# EAGLE design rfm12trx (EAGLE 6.0)
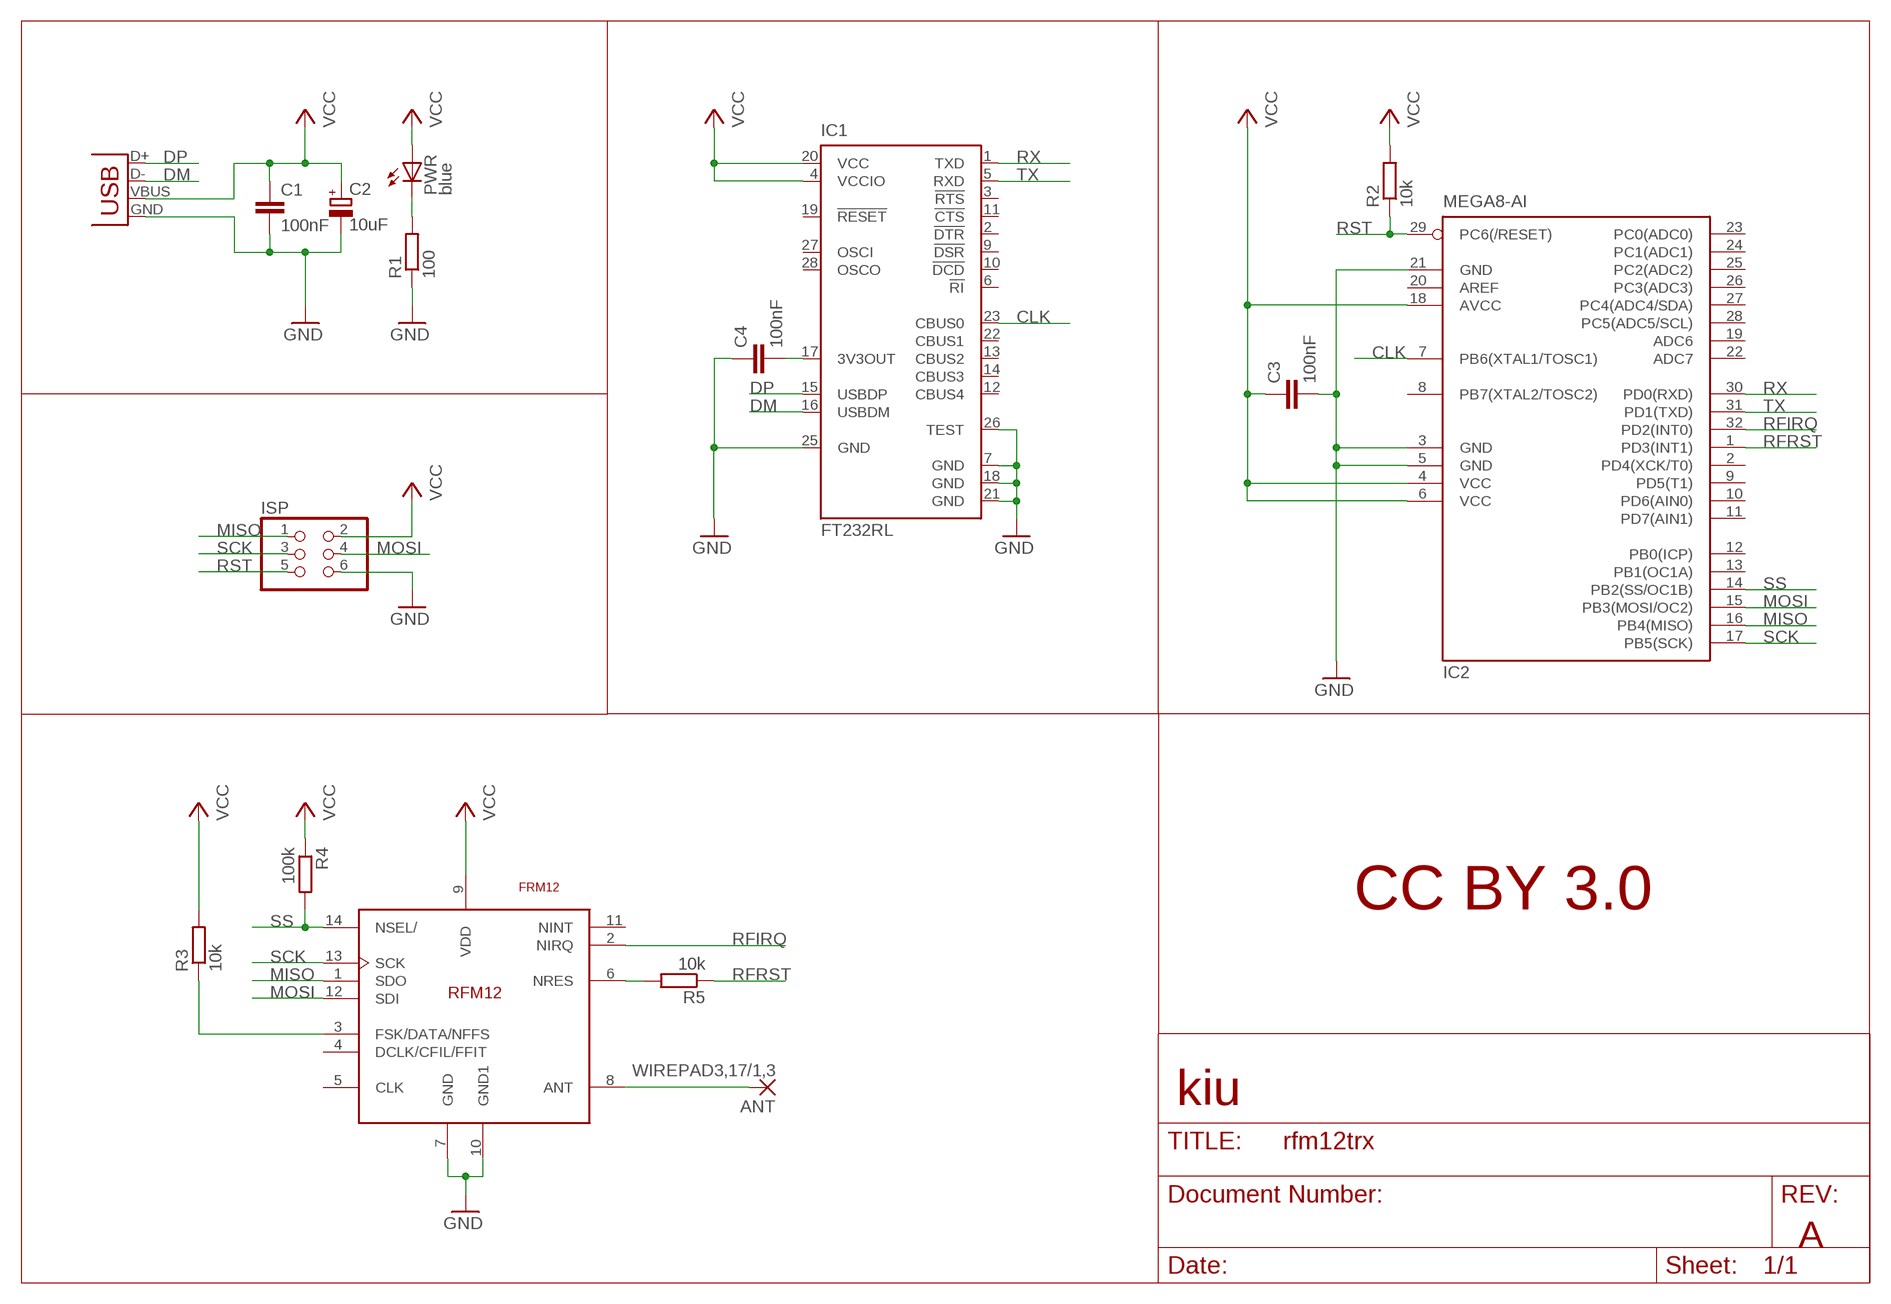
[diagram p0: schematic, sheet 1]

## Parts
ANT  WIREPAD3,17/1,3  [3,17/1,3]
C1  100nF  C-EUC0603  [C0603]
C2  10uF  CPOL-EUCT3216  [CT3216]
C3  100nF  C-EUC0603  [C0603]
C4  100nF  C-EUC0603  [C0603]
IC1  FT232RL  [SSOP28]
IC2  MEGA8-AI  [TQFP32-08]
ISP  PINHD-2X3  [2X03]
PWR  blue  LEDCHIP-LED0805  [CHIP-LED0805]
R1  100  R-EU_R0603  [R0603]
R2  10k  R-EU_R0603  [R0603]
R3  10k  R-EU_R0603  [R0603]
R4  100k  R-EU_R0603  [R0603]
R5  10k  R-EU_R0603  [R0603]
U$1  FRM12  [RFM12]
X1  USB-MICROB  [USB-MICROB]

## Nets
CLK: IC1.23(CBUS0) IC2.7(PB6(XTAL1/TOSC1))
DM: IC1.16(USBDM) X1.D-
DP: IC1.15(USBDP) X1.D+
GND: C1.2 C2.- C3.2 C4.1 IC1.7(GND) IC1.18(GND) IC1.21(GND) IC1.25(GND) IC1.26(TEST) IC2.3(GND) IC2.5(GND) IC2.21(GND) ISP.6 R1.1 U$1.7(GND) U$1.10(GND1) X1.GND
MISO: IC2.16(PB4(MISO)) ISP.1 U$1.1(SDO)
MOSI: IC2.15(PB3(MOSI/OC2)) ISP.4 U$1.12(SDI)
N$2: PWR.C R1.2
N$3: C4.2 IC1.17(3V3OUT)
N$13: R3.1 U$1.3(FSK/DATA/NFFS)
N$14: R5.2 U$1.6(NRES)
N$16: ANT.1(P) U$1.8(ANT)
RFIRQ: IC2.32(PD2(INT0)) U$1.2(NIRQ)
RFRST: IC2.1(PD3(INT1)) R5.1
RST: IC2.29(PC6(/RESET)) ISP.5 R2.1
RX: IC1.1(TXD) IC2.30(PD0(RXD))
SCK: IC2.17(PB5(SCK)) ISP.3 U$1.13(SCK)
SS: IC2.14(PB2(SS/OC1B)) R4.2 U$1.14(NSEL/)
TX: IC1.5(RXD) IC2.31(PD1(TXD))
VCC: C1.1 C2.+ C3.1 IC1.4(VCCIO) IC1.20(VCC) IC2.4(VCC) IC2.6(VCC) IC2.18(AVCC) ISP.2 PWR.A R2.2 R3.2 R4.1 U$1.9(VDD) X1.VBUS
Unconnected: IC1.2(!DTR) IC1.3(!RTS) IC1.6(!RI) IC1.9(!DSR) IC1.10(!DCD) IC1.11(!CTS) IC1.12(CBUS4) IC1.13(CBUS2) IC1.14(CBUS3) IC1.19(!RESET) IC1.22(CBUS1) IC1.27(OSCI) IC1.28(OSCO) IC2.2(PD4(XCK/T0)) IC2.8(PB7(XTAL2/TOSC2)) IC2.9(PD5(T1)) IC2.10(PD6(AIN0)) IC2.11(PD7(AIN1)) IC2.12(PB0(ICP)) IC2.13(PB1(OC1A)) IC2.19(ADC6) IC2.20(AREF) IC2.22(ADC7) IC2.23(PC0(ADC0)) IC2.24(PC1(ADC1)) IC2.25(PC2(ADC2)) IC2.26(PC3(ADC3)) IC2.27(PC4(ADC4/SDA)) IC2.28(PC5(ADC5/SCL)) U$1.4(DCLK/CFIL/FFIT) U$1.5(CLK) U$1.11(NINT)

## Notes on the sheet
- CC BY 3.0
- kiu
- A

## Library data of the parts
ANT = wirepad:WIREPAD: Wire PAD connect wire on PCB
C1 C3 C4 = rcl:C-EU: CAPACITOR, European symbol
C2 = rcl:CPOL-EU: POLARIZED CAPACITOR, European symbol
IC1 = ftdichip:FT232R: Source: http://www.ftdichip.com/Documents/DataSheets/DS_FT232R_v104.pdf; MPN: FT232RL; OC_FARNELL: 1146032; OC_NEWARK: 91K9918
IC2 = atmel:MEGA8: MICROCONTROLLER 8 Kbytes FLASH, 1 kbytes SRAM, 512 bytes EEPROM, USART, 6-channel 10 bit ADC, 2-channel 8 bit ADC Pin compatible with Atmega48, ATMega88, ATMega168 Source: avr.lbr; MPN: ATMEGA8-16AU; OC_FARNELL: 9171371; OC_NEWARK: 73M8863
ISP = pinhead:PINHD-2X3: PIN HEADER
PWR = led:LED: LED OSRAM: - CHIPLED LG R971, LG N971, LY N971, LG Q971, LY Q971, LO R971, LY R971 LH N974, LH R974 LS Q976, LO Q976, LY Q976 LO Q996 - Hyper CHIPLED LW Q18S LB Q993, LB Q99A, LB R99A - SideLED LS A670, LO A670, LY A670, LG A670, LP A670 LB A673, LV A673, LT A673, LW A673 LH A674 LY A675 LS A676, LA A676, LO A676, LY A676, LW A676 LS A679, LY A679, LG A679 - Hyper Micro SIDELED® LS Y876, LA Y876, LO Y876, LY Y876 LT Y87S - SmartLED LW L88C, LW L88S LB L89C, LB L89S, LG L890 LS L89K, LO L89K, LY L89K LS L896, LA L896, LO L896, LY L896 - TOPLED LS T670, LO T670, LY T670, LG T670, LP T670 LSG T670, LSP T670, LSY T670, LOP T670, LYG T670 LG T671, LOG T671, LSG T671 LB T673, LV T673, LT T673, LW T673 LH T674 LS T676, LA T676, LO T676, LY T676, LB T676, LH T676, LSB T676, LW T676 LB T67C, LV T67C, LT T67C, LS T67K, LO T67K, LY T67K, LW E67C LS E67B, LA E67B, LO E67B, LY E67B, LB E67C, LV E67C, LT E67C LW T67C LS T679, LY T679, LG T679 LS T770, LO T770, LY T770, LG T770, LP T770 LB T773, LV T773, LT T773, LW T773 LH T774 LS E675, LA E675, LY E675, LS T675 LS T776, LA T776, LO T776, LY T776, LB T776 LHGB T686 LT T68C, LB T68C - Hyper Mini TOPLED® LB M676 - Mini TOPLED Santana® LG M470 LS M47K, LO M47K, LY M47K Source: http://www.osram.convergy.de LUXEON: - LUMILED® LXK2-PW12-R00, LXK2-PW12-S00, LXK2-PW14-U00, LXK2-PW14-V00 LXK2-PM12-R00, LXK2-PM12-S00, LXK2-PM14-U00 LXK2-PE12-Q00, LXK2-PE12-R00, LXK2-PE12-S00, LXK2-PE14-T00, LXK2-PE14-U00 LXK2-PB12-K00, LXK2-PB12-L00, LXK2-PB12-M00, LXK2-PB14-N00, LXK2-PB14-P00, LXK2-PB14-Q00 LXK2-PR12-L00, LXK2-PR12-M00, LXK2-PR14-Q00, LXK2-PR14-R00 LXK2-PD12-Q00, LXK2-PD12-R00, LXK2-PD12-S00 LXK2-PH12-R00, LXK2-PH12-S00 LXK2-PL12-P00, LXK2-PL12-Q00, LXK2-PL12-R00 Source: www.luxeon.com KINGBRIGHT: KA-3528ASYC Source: www.kingbright.com
R1-R5 = rcl:R-EU_: RESISTOR, European symbol
U$1 = rfm12:FRM12
X1 = SparkFun:USB: USB Connectors USB-B-PTH is fully proven SKU : PRT-00139 USB-miniB is fully proven SKU : PRT-00587 USB-A-PCB is untested. USB-A-H is throughly reviewed, but untested. Spark Fun Electronics SKU : PRT-00437 USB-B-SMT is throughly reviewed, but untested. Needs silkscreen touching up. USB-A-S has not been used/tested USB-MB-H has not been used/tested

## Board
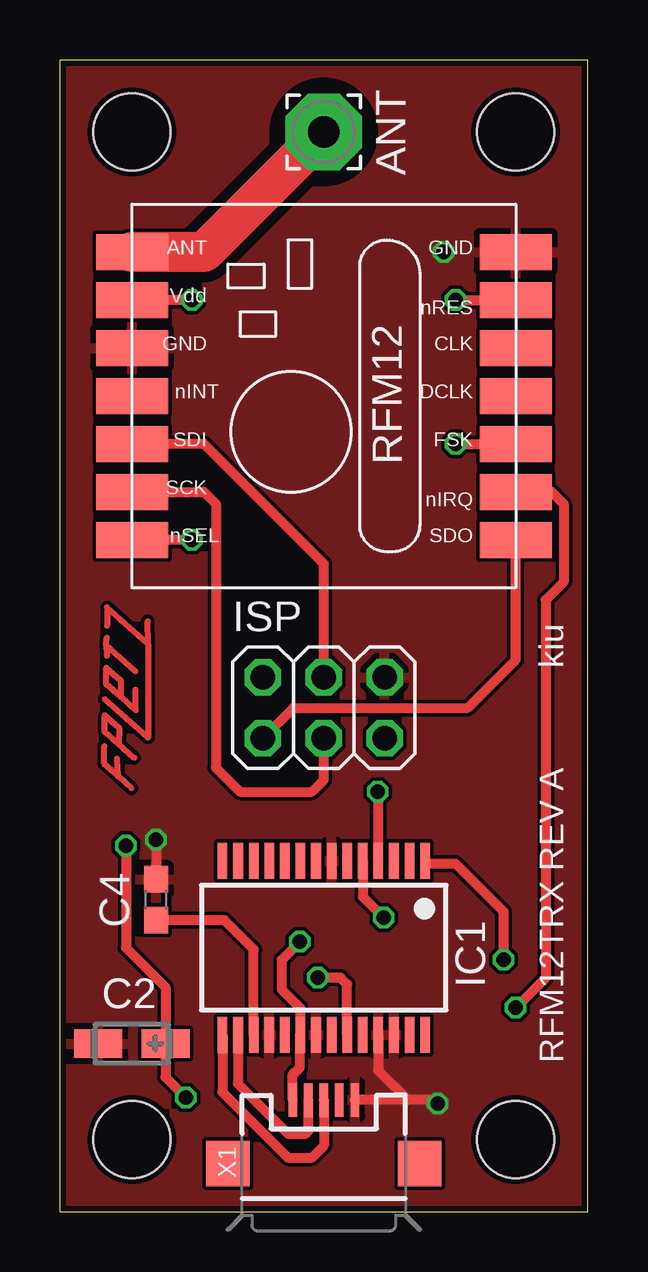
[diagram p1: board, top side]
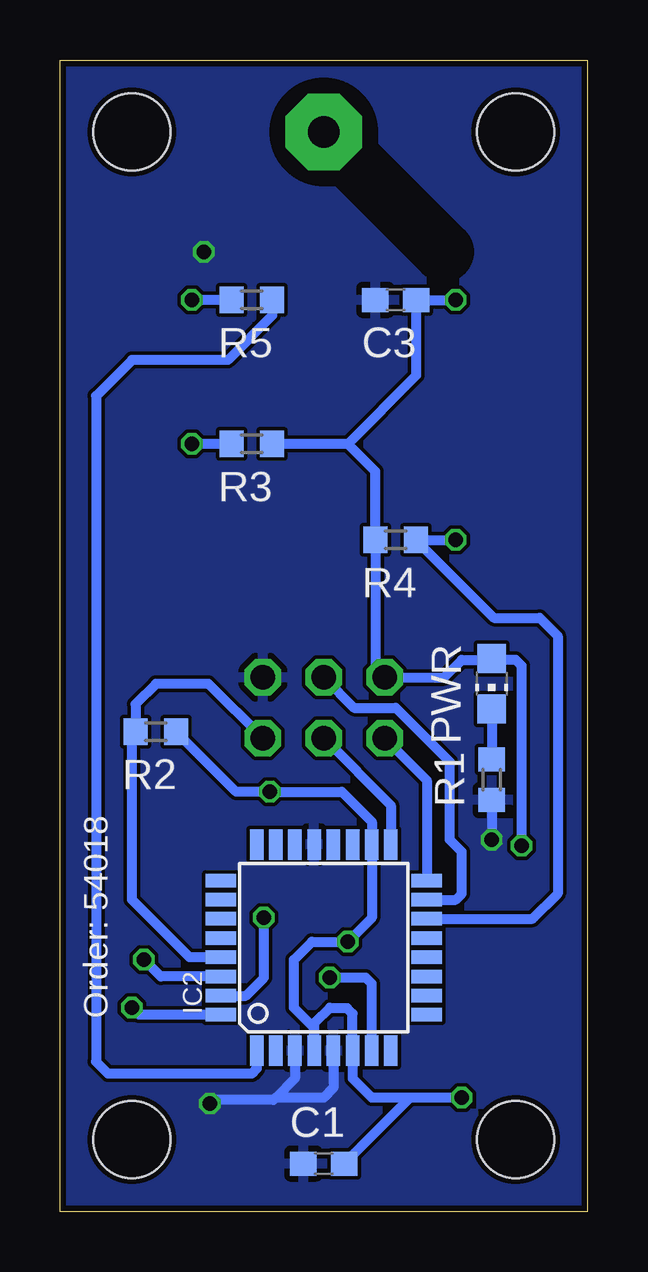
[diagram p2: board, bottom side, seen from below]

Size 22 x 48 mm. Coordinates in mm from the lower left corner, seen from the top.
Outline: 22,48 0,48 0,0 22,0 22,48
Copper layers (1*16): Top 0.035mm / dielectric 1.5mm / Bottom 0.035mm
Design rules: minimum track width 6mil, minimum drill 12mil, track to track 6mil, track to pad 6mil, pad to pad 6mil, via to via 6mil, smd to smd 0mil, copper to edge 10mil, drill to drill 10mil, minimum pad ring 10mil, minimum via ring 6mil, stop-mask expansion 2mil, vias tented up to drill 100mil, thermal gap 10mil
Holes 3.2 mm at 3,3 19,3 3,45 19,45
tRestrict: area 10,44 to 12,46; 1 lines
bRestrict: area 10,44 to 12,46; 1 lines

### Footprints (pad centres in the part's own frame; a part is rotated, then mirrored left to right if it is on the bottom)
3,17/1,3 = drill 1.321 pad 3.175 octagon: 1 0,0
C0603 = smd 1.1 x 1: 1 -0.85,0; 2 0.85,0
CT3216 = smd 2 x 1.2: + -1.4,0; - 1.4,0
SSOP28 = smd 0.4 x 1.5: 1 -4.225,-3.625; 2 -3.575,-3.625; 3 -2.925,-3.625; 4 -2.275,-3.625; 5 -1.625,-3.625; 6 -0.975,-3.625; 7 -0.325,-3.625; 8 0.325,-3.625; 9 0.975,-3.625; 10 1.625,-3.625; 11 2.275,-3.625; 12 2.925,-3.625; 13 3.575,-3.625; 14 4.225,-3.625; 15 4.225,3.625; 16 3.575,3.625; 17 2.925,3.625; 18 2.275,3.625; 19 1.625,3.625; 20 0.975,3.625; 21 0.325,3.625; 22 -0.325,3.625; 23 -0.975,3.625; 24 -1.625,3.625; 25 -2.275,3.625; 26 -2.925,3.625; 27 -3.575,3.625; 28 -4.225,3.625
TQFP32-08 = smd 1.27 x 0.559: 1 -4.293,2.8; 2 -4.293,2; 3 -4.293,1.2; 4 -4.293,0.4; 5 -4.293,-0.4; 6 -4.293,-1.2; 7 -4.293,-2; 8 -4.293,-2.8; 17 4.293,-2.8; 18 4.293,-2; 19 4.293,-1.2; 20 4.293,-0.4; 21 4.293,0.4; 22 4.293,1.2; 23 4.293,2; 24 4.293,2.8 | smd 0.559 x 1.27: 9 -2.8,-4.293; 10 -2,-4.293; 11 -1.2,-4.293; 12 -0.4,-4.293; 13 0.4,-4.293; 14 1.2,-4.293; 15 2,-4.293; 16 2.8,-4.293; 25 2.8,4.293; 26 2,4.293; 27 1.2,4.293; 28 0.4,4.293; 29 -0.4,4.293; 30 -1.2,4.293; 31 -2,4.293; 32 -2.8,4.293
2X03 = drill 1.016 octagon: 1 -2.54,-1.27; 2 -2.54,1.27; 3 0,-1.27; 4 0,1.27; 5 2.54,-1.27; 6 2.54,1.27
CHIP-LED0805 = smd 1.2 x 1.2: A 0,-1.05; C 0,1.05
R0603 = smd 1 x 1.1: 1 -0.85,0; 2 0.85,0
RFM12 = smd 1.5 x 3: 1 -5,-10; 2 -3,-10; 3 -1,-10; 4 1,-10; 5 3,-10; 6 5,-10; 7 7,-10; 8 7,6; 9 5,6; 10 3,6; 11 1,6; 12 -1,6; 13 -3,6; 14 -5,6
USB-MICROB = smd 0.35 x 1.4: D+ 0,2.65; D- -0.65,2.65; GND 1.3,2.65; ID 0.65,2.65; VBUS -1.3,2.65 | smd 1.8 x 1.9: MT1 -4,0; MT2 4,0

### Placement (x,y rotation side)
ANT  11,45 0 top
C1  11,2 180 bottom
C2  3,7 180 top
C3  8,38 180 bottom
C4  4,13 270 top
IC1  11,11 180 top
IC2  11,11 90 bottom
ISP  11,21 0 top
PWR  4,22 180 bottom
R1  4,18 90 bottom
R2  18,20 0 bottom
R3  14,32 0 bottom
R4  8,28 0 bottom
R5  14,38 180 bottom
U$1  9,33 90 top
X1  11,2 0 top

### Tracks (layer width: path | path; a pad name or v marks a point on that pad's centre or on a via)
CLK  (via drill 0.6)
  Top 0.406: IC1.23 11.97,9.47 11.7,9.75 v10.75,9.75
  Bottom 0.406: IC2.7 9,9.5 9.25,9.75 v10.75,9.75
DM
  Top 0.406: X1.D- 10.35,3.35 10.25,3.25 9.5,3.25 7.42,5.33 IC1.16
DP
  Top 0.406: X1.D+ 11,2.75 10.5,2.25 9.5,2.25 6.78,4.97 IC1.15
GND  (via drill 0.6)
  Top 0.406: v4,15.5 C4.1 | v15.75,4.5 15.6,4.65 14.5,4.65 | 14.5,4.65 X1.GND | IC1.25 13.28,5.88 14.5,4.65
  Bottom 0.406: R1.1 v4,15.5 | IC2.3 12.2,5.55 13,4.75 | 13,4.75 13.1,4.65 15.6,4.65 v15.75,4.5 | IC2.5 10.6,5.15 11,4.75 13,4.75
  other vias: 16,40
  pour Top: -1,49 23,49 23,-1 -1,-1
  pour Bottom: -1,49 23,49 23,-1 -1,-1
MISO
  Top 0.406: ISP.1 9.73,21 17,21 19,23 U$1.1
  Bottom 0.406: ISP.1 6.71,17.98 IC2.16
MOSI
  Top 0.406: U$1.12 6,32 11,27 ISP.4
  Bottom 0.406: ISP.4 9.73,21 8,21 5.75,18.75 5.75,15.5 5.25,15 5.25,13.25 5.5,13 IC2.15
N$1
  Top 0.254: 2.48,19.46 1.86,20.01 1.87,20.68 2.48,20.13 2.48,19.46 | 3.09,18.91 2.48,19.46
N$2
  Bottom 0.406: PWR.C R1.2
N$3
  Top 0.406: IC1.17 8.07,10.93 6.85,12.15 C4.2
N$4
  Top 0.254: 1.87,21.36 3.67,19.75 3.67,23.67 | 1.97,24.42 1.97,25.19 3.67,23.67 | 3.67,23.67 3.67,24.61
N$5
  Top 0.254: 1.92,23.61 1.95,23.16 | 3.16,22.51 1.92,23.61 | 1.92,23.61 1.95,23.93
N$13  (via drill 0.6)
  Top 0.406: v16.5,32 U$1.3
  Bottom 0.406: R3.1 v16.5,32
N$14  (via drill 0.6)
  Top 0.406: v16.5,38 U$1.6
  Bottom 0.406: R5.2 v16.5,38
N$15
  Top 0.254: 3.15,21.75 3.16,20.89 2.54,21.44 | 2.54,21.44 1.93,21.99 1.93,22.67 2.55,22.12 2.54,21.44
N$16
  Top 1.676: U$1.8 6,40 ANT.1
N$19
  Top 0.254: 1.85,19.4 1.85,18.66 2.42,18.15 | 2.42,18.15 2.99,17.64 | 2.42,18.15 2.38,18.87
RFIRQ  (via drill 0.6)
  Top 0.406: U$1.2 20.5,30 21,29.5 21,26.25 20.25,25.5 20.25,9.75 v19,8.5
  Bottom 0.406: IC2.32 18.7,8.2 v19,8.5
RFRST
  Bottom 0.406: R5.1 13.15,37.35 15,35.5 19,35.5 20.5,34 20.5,6.25 20,5.75 14,5.75 13.8,5.95 IC2.1
RST
  Bottom 0.406: IC2.29 16.6,10.6 19,13 19,19.85 R2.1 18.85,21.15 18,22 15.81,22 ISP.5
RX  (via drill 0.6)
  Top 0.406: v18.5,10.5 18.5,12.5 16.5,14.5 15.35,14.5 IC1.1
  Bottom 0.406: IC2.30 17.8,9.8 v18.5,10.5
SCK
  Top 0.406: U$1.13 6,30 6.5,29.5 6.5,18.5 7.5,17.5 10.5,17.5 11,18 ISP.3
  Bottom 0.406: ISP.3 8.2,16.93 IC2.17
SS  (via drill 0.6)
  Top 0.406: v5.5,28 U$1.14
  Bottom 0.406: v5.5,28 R4.2 3.9,24.75 2,24.75 1.25,24 1.25,13.25 2.3,12.2 IC2.14
TX  (via drill 0.6)
  Top 0.406: IC1.5 12.62,13.12 v13.5,12.25
  Bottom 0.406: IC2.31 14.25,9 13.5,9.75 v13.5,12.25
VCC  (via drill 0.6)
  Top 0.406: X1.VBUS 9.7,5.7 10,6 10,7.35 IC1.20 10.03,8.47 9.25,9.25 9.25,10.5 v10,11.25 | v5.5,38 U$1.9 | v2.75,15.25 2.75,11 4.4,9.35 C2.+ 4.4,5.6 v5.25,4.75 | IC1.4 13.28,17.48 v13.25,17.5
  Bottom 0.406: 10,32 7.15,34.85 C3.1 v5.5,38 | 10,32 R3.2 | 10,32 8.85,30.85 R4.1 8.85,22.66 ISP.2 5.98,22.27 5.25,23 4.05,23 PWR.A 3.95,23 3,23 2.75,22.75 v2.75,15.25 | 17.15,19.65 R2.2 14.65,17.5 v13.25,17.5 10.25,17.5 9,16.25 IC2.18 9,12.25 v10,11.25 11.5,11.25 12.25,10.5 12.25,8.5 11.4,7.65 IC2.4 11.4,7.85 10.75,8.5 10.72,8.47 10.03,8.47 9.8,8.25 IC2.6 9.8,5.55 9,4.75 7.4,4.75 | 10.25,2.1 C1.1 7.4,4.75 | v5.25,4.75 7.4,4.75

### Text on the board
tNames: kiu | RFM12TRX REV A
bNames: Order: 54018